# EAGLE design gyro+acc (EAGLE 6.1)
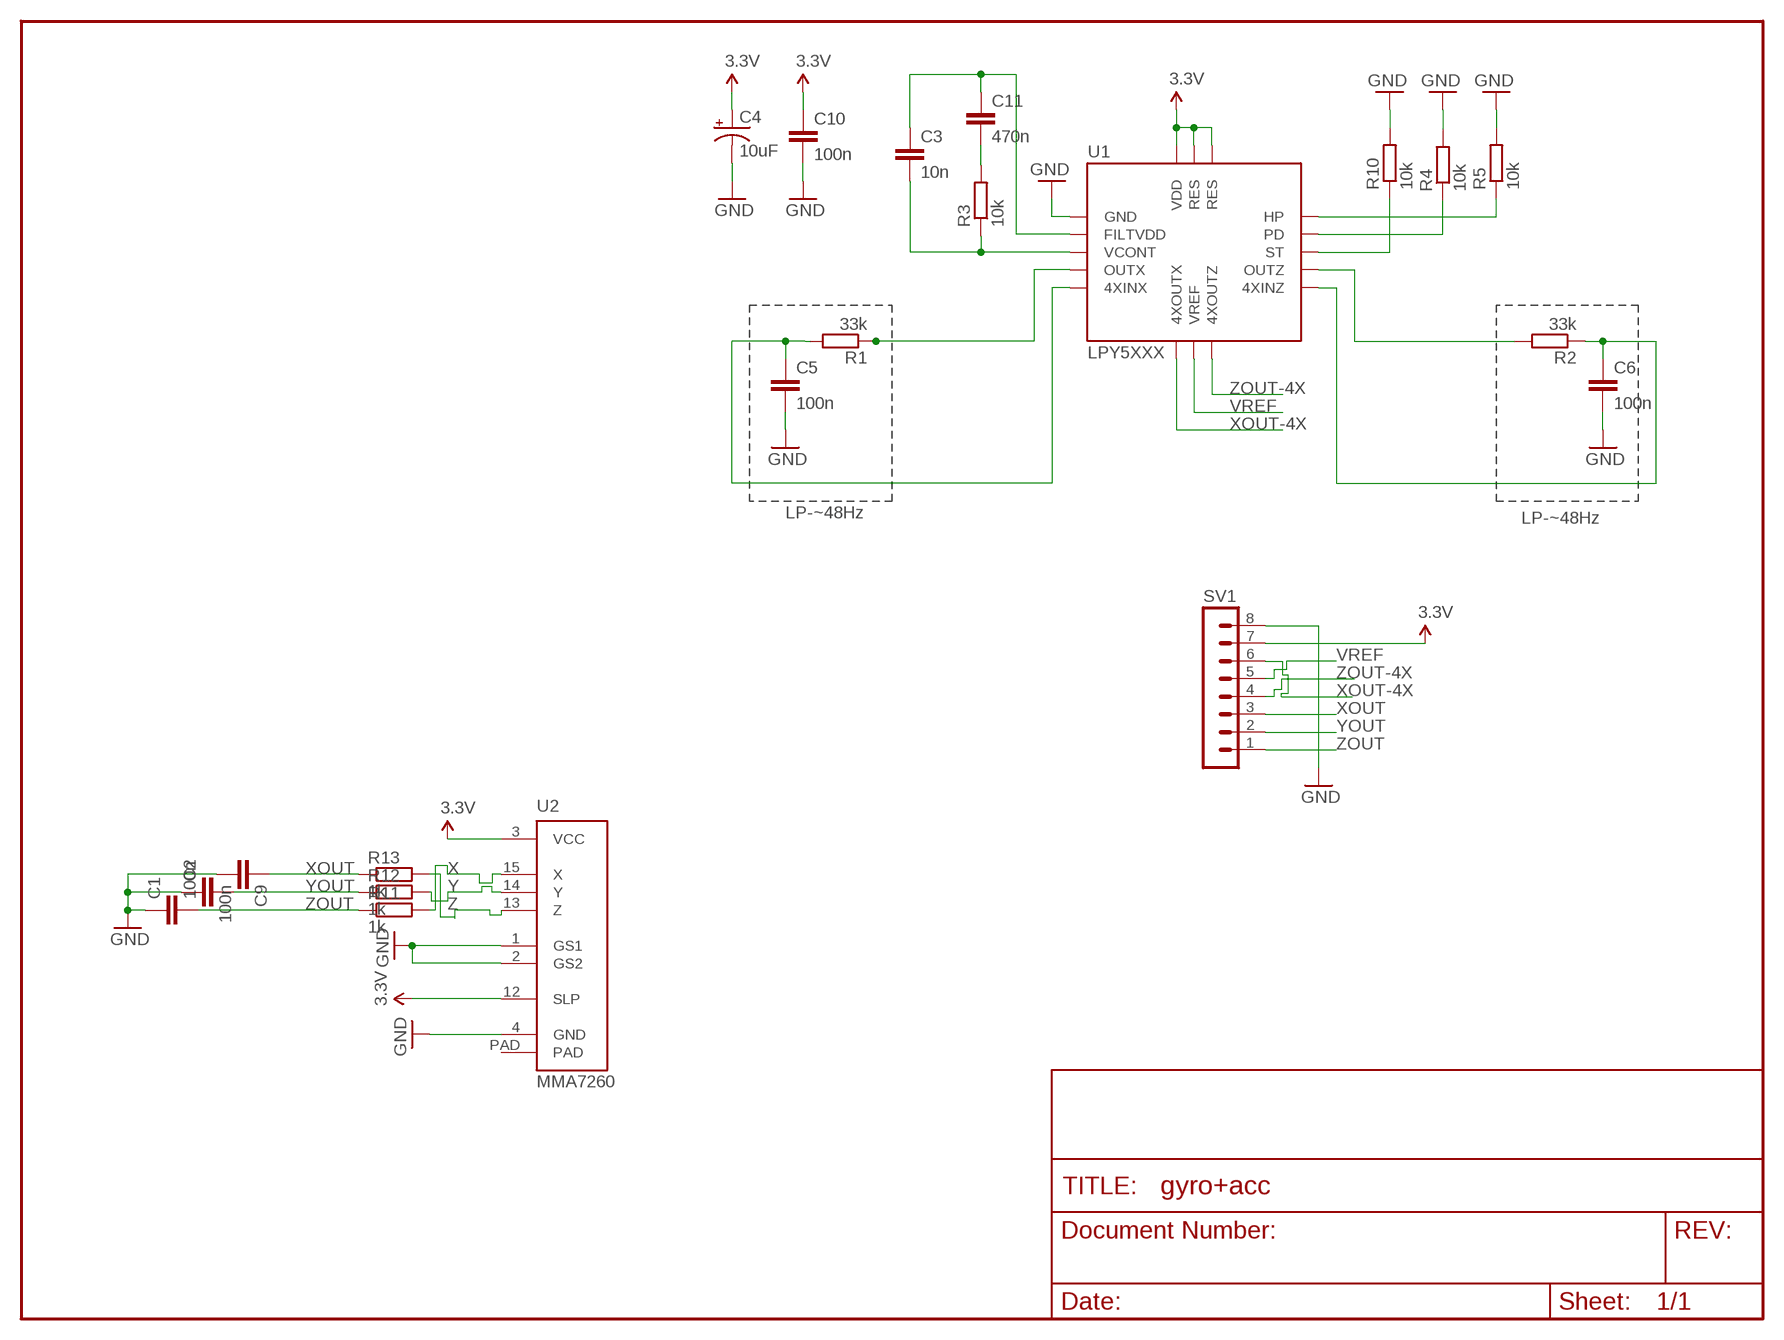
[diagram p0: schematic, sheet 1]

## Parts
C1  100n  C-EUC1206  [C1206]
C2  C-EUC1206  [C1206]
C3  10n  C-EUC1206  [C1206]
C4  10uF  CAP_POL1206  [EIA3216]
C5  100n  C-EUC1206  [C1206]
C6  100n  C-EUC1206  [C1206]
C9  100n  C-EUC1206  [C1206]
C10  100n  C-EUC1206  [C1206]
C11  470n  C-EUC1206  [C1206]
R1  33k  R-EU_M1206  [M1206]
R2  33k  R-EU_M1206  [M1206]
R3  10k  R-EU_M1206  [M1206]
R4  10k  R-EU_M1206  [M1206]
R5  10k  R-EU_M1206  [M1206]
R10  10k  R-EU_M1206  [M1206]
R11  1k  R-EU_M1206  [M1206]
R12  1k  R-EU_M1206  [M1206]
R13  1k  R-EU_M1206  [M1206]
SV1  MA08-1  [MA08-1]
U1  LPY5XXX  ST-GYRO-PYSMD  [ST-GYRO]
U2  MMA7260  [MMA7260]

## Nets
3.3V: C4.A(+) C10.1 SV1.7 U1.14(RES) U1.15(RES) U1.16(VDD) U2.3(VCC) U2.12(SLP)
F1: C3.1 C11.1 U1.2(FILTVDD)
F2: C3.2 R3.1 U1.3(VCONT)
GND: C1.1 C2.1 C4.C(-) C5.2 C6.2 C9.2 C10.2 R4.2 R5.2 R10.2 SV1.8 U1.1(GND) U2.1(GS1) U2.2(GS2) U2.4(GND)
HP: R5.1 U1.13(HP)
N$1: R1.1 U1.4(OUTX)
N$2: C11.2 R3.2
N$3: R2.2 U1.10(OUTZ)
PD: R4.1 U1.12(PD)
ST: R10.1 U1.11(ST)
VREF: SV1.5 U1.7(VREF)
X: R11.2 U2.15(X)
XOUT: C9.1 R13.1 SV1.3
XOUT-1X: C5.1 R1.2 U1.5(4XINX)
XOUT-4X: SV1.6 U1.6(4XOUTX)
Y: R12.2 U2.14(Y)
YOUT: C2.2 R12.1 SV1.2
Z: R13.2 U2.13(Z)
ZOUT: C1.2 R11.1 SV1.1
ZOUT-1X: C6.1 R2.1 U1.9(4XINZ)
ZOUT-4X: SV1.4 U1.8(4XOUTZ)
Unconnected: U2.PAD

## Notes on the sheet
- LP-~48Hz
- LP-~48Hz

## Library data of the parts
C1-C3 C5 C6 C9-C11 = rcl:C-EU: CAPACITOR, European symbol
C4 = SparkFun:CAP_POL: Capacitor Polarized These are standard SMD and PTH capacitors. Normally 10uF, 47uF, and 100uF in electrolytic and tantalum varieties. Always verify the external diameter of the through hole cap, it varies with capacity, voltage, and manufacturer. The EIA devices should be standard.
R1-R5 R10-R13 = resistor:R-EU_: RESISTOR, European symbol
SV1 = con-lstb:MA08-1: PIN HEADER; OC_FARNELL: unknown; OC_NEWARK: unknown
U1 = SparkFun:ST-GYRO-PY
U2 = SparkFun:MMA7260: MMA7260Q Triple axis accelerometer from Freescale. Schematic element and footprint production proven. Center pad has reduced paste layer for solder short reduction. Spark Fun Electronics SKU : COM-00308

## Board
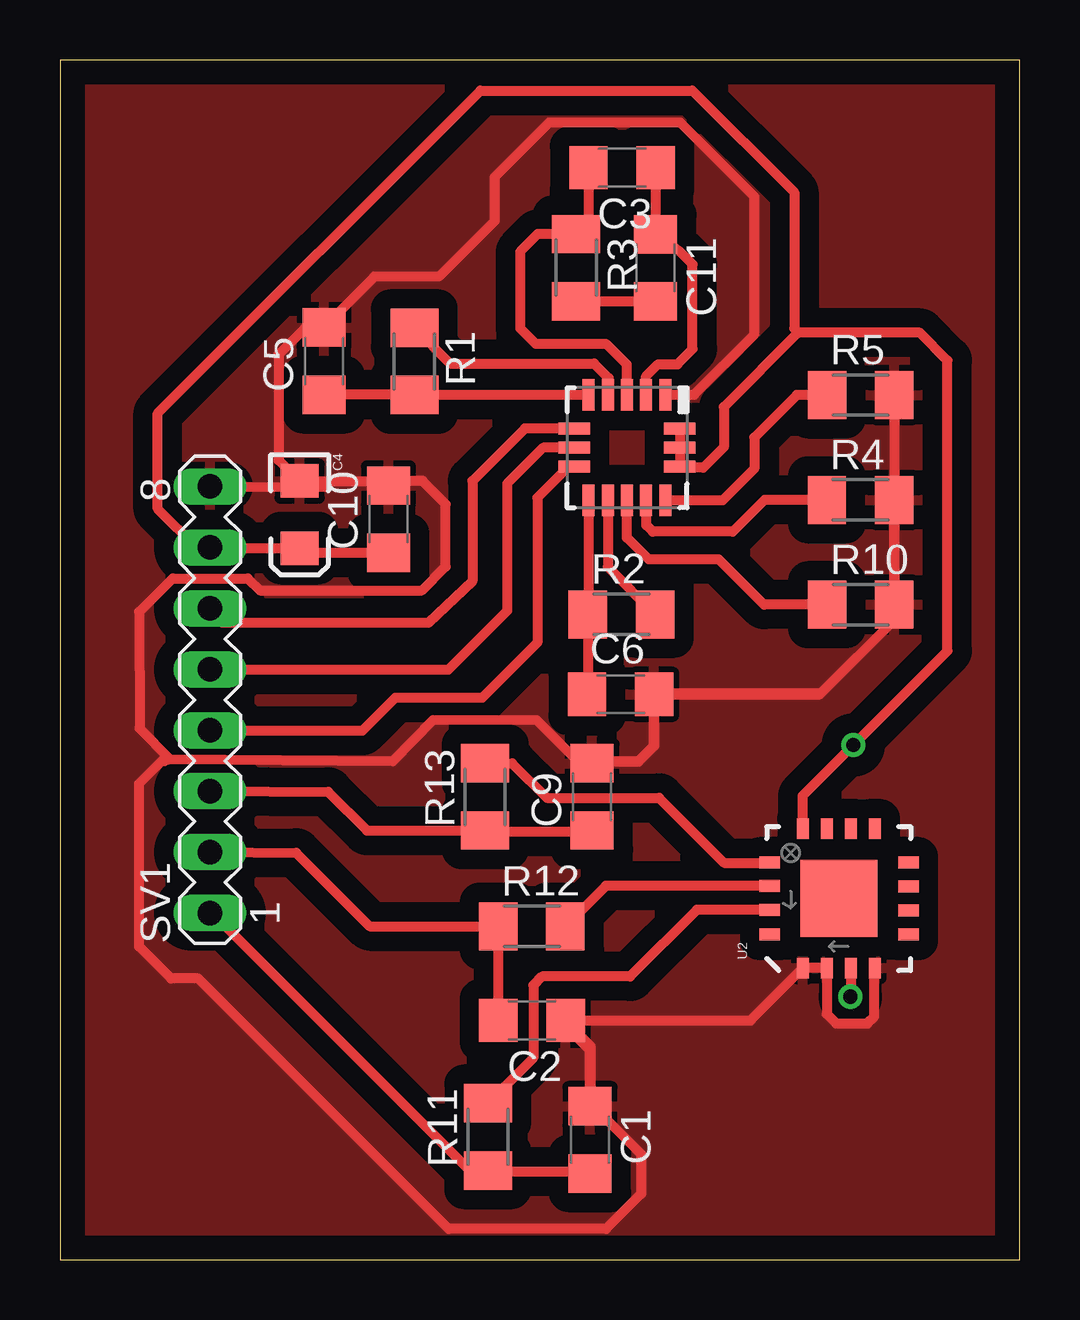
[diagram p1: board, top side]
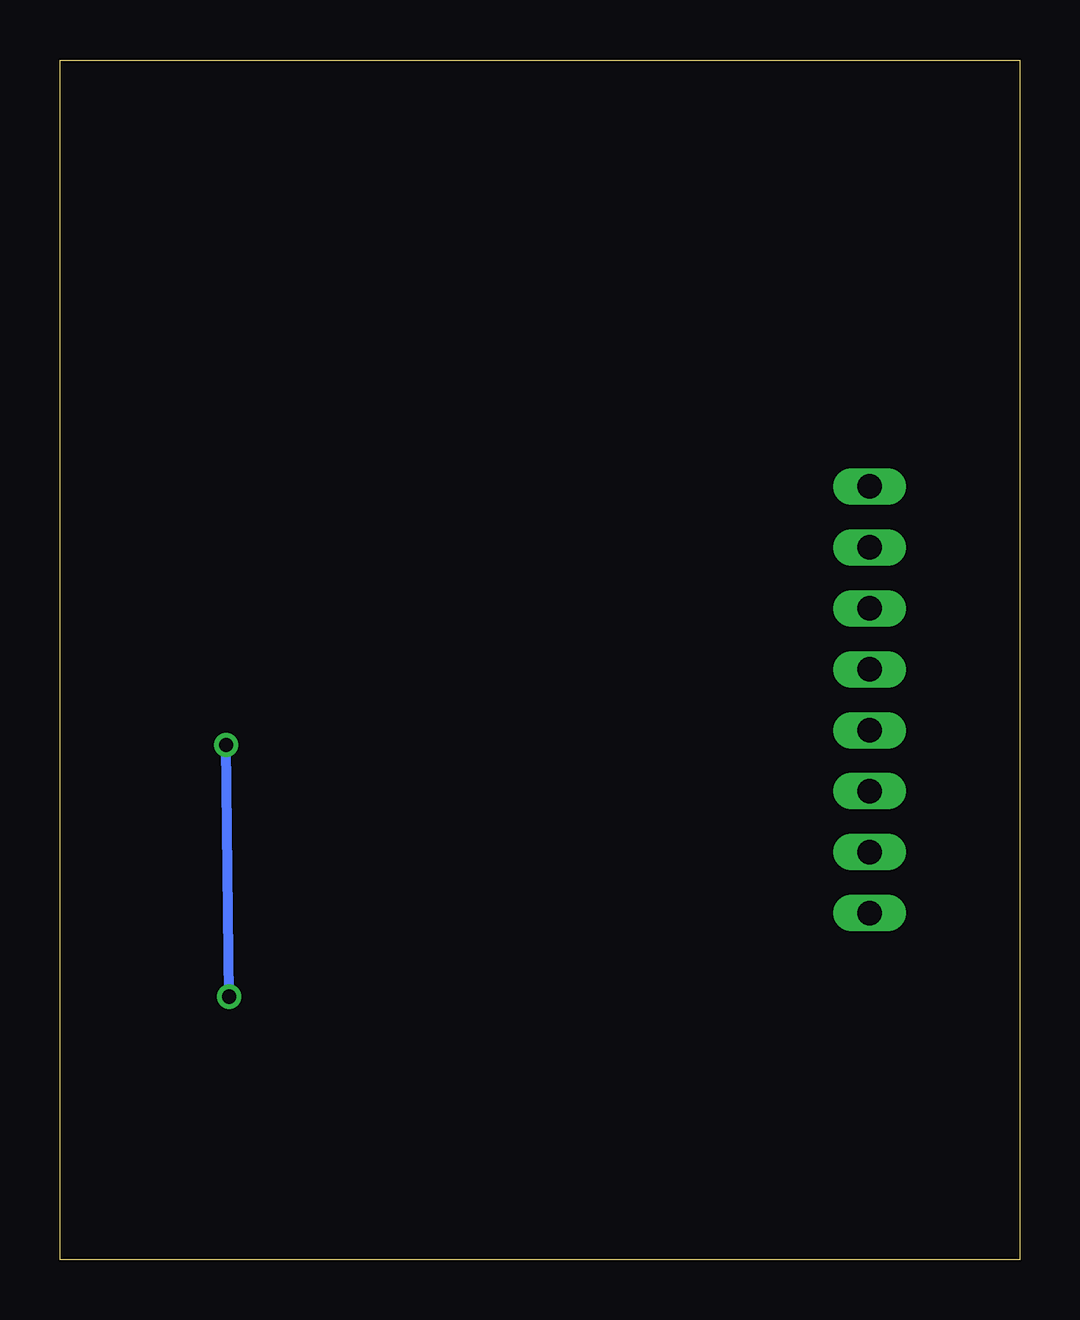
[diagram p2: board, bottom side, seen from below]

Size 40 x 50 mm. Coordinates in mm from the lower left corner, seen from the top.
Outline: 0,0 40,0 40,50 0,50 0,0
Copper layers (1*16): Top 0.035mm / dielectric 1.5mm / Bottom 0.035mm
Design rules: minimum track width 10mil, minimum drill 24mil, track to track 8mil, track to pad 8mil, pad to pad 8mil, via to via 8mil, smd to smd 8mil, copper to edge 40mil, drill to drill 8mil, minimum pad ring 10mil, minimum via ring 8mil, stop-mask expansion 4mil, vias tented up to drill 0mil, thermal gap 10mil

### Footprints (pad centres in the part's own frame; a part is rotated, then mirrored left to right if it is on the bottom)
C1206 = smd 1.6 x 1.8: 1 -1.4,0; 2 1.4,0
EIA3216 = smd 1.4 x 1.6: A 1.4,0; C -1.4,0
M1206 = smd 1.6 x 2: 1 -1.4,0; 2 1.4,0
MA08-1 = drill 1.016 long: 1 -8.89,0; 2 -6.35,0; 3 -3.81,0; 4 -1.27,0; 5 1.27,0; 6 3.81,0; 7 6.35,0; 8 8.89,0
ST-GYRO = smd 1.3 x 0.5: 1 -2.2,1.6; 2 -2.2,0.8; 3 -2.2,0; 4 -2.2,-0.8; 5 -2.2,-1.6; 9 2.2,-1.6; 10 2.2,-0.8; 11 2.2,0; 12 2.2,0.8; 13 2.2,1.6 | smd 0.5 x 1.3: 6 -0.8,-2.2; 7 0,-2.2; 8 0.8,-2.2; 14 0.8,2.2; 15 0,2.2; 16 -0.8,2.2
MMA7260 = smd 0.855 x 0.5: 1 -2.902,1.5; 2 -2.902,0.5; 3 -2.902,-0.5; 4 -2.902,-1.5; 9 2.902,-1.5; 10 2.902,-0.5; 11 2.902,0.5; 12 2.902,1.5 | smd 0.5 x 0.855: 5 -1.5,-2.902; 6 -0.5,-2.902; 7 0.5,-2.902; 8 1.5,-2.902; 13 1.5,2.877; 14 0.525,2.877; 15 -0.475,2.877; 16 -1.5,2.877 | smd 3.2 x 3.2: PAD 0,0

### Placement (x,y rotation side)
C1  22.1,4.99 270 top
C2  19.68,9.97 180 top
C3  23.43,45.51 180 top
C4  9.99,31.05 270 top
C5  11.01,37.45 90 top
C6  23.37,23.56 0 top
C9  22.18,19.29 90 top
C10  13.69,30.86 90 top
C11  24.83,41.34 270 top
R1  14.77,37.43 270 top
R2  23.41,26.9 0 top
R3  21.52,41.34 270 top
R4  33.37,31.66 0 top
R5  33.38,36.04 0 top
R10  33.38,27.29 0 top
R11  17.84,5.12 90 top
R12  19.67,13.89 0 top
R13  17.72,19.28 90 top
SV1  6.26,23.33 90 top
U1  23.64,33.84 270 top
U2  32.46,15.05 90 top

### Tracks (layer width: path | path; a pad name or v marks a point on that pad's centre or on a via)
3.3V  (via drill 0.6)
  Top 0.406: U1.16 U1.15 U1.14 25.86,33.06 25.82,33.02 25.84,33.01 26.82,33.01 27.67,33.86 27.67,35.53 30.77,38.63 | U2.12 30.96,19.34 v33.07,21.45 37,25.37 37,37.48 35.84,38.63 30.77,38.63 | 30.77,38.63 30.78,38.62 | 30.77,38.63 30.71,38.69 30.71,38.7 30.61,38.81 30.61,44.48 26.36,48.72 17.53,48.72 4.08,35.27 4.08,31.28 5.73,29.63 5.78,29.67 SV1.7 | SV1.7 6.3,29.67 6.32,29.65 C4.A 10.18,29.46 C10.1 | SV1.7 | U2.3 32.96,10.97 v32.95,10.96
  Bottom 0.406: v32.95,10.96 v33.07,21.45
F1
  Top 0.406: C3.1 C11.1 24.82,42.73 24.81,42.73 | U1.2 24.43,36.82 24.93,37.32 25.74,37.32 26.37,37.95 26.37,41.48 25.85,42.01 24.81,42.73 | 24.81,42.73 24.76,42.73 | 24.73,42.73 24.76,42.73 | 24.76,42.73 24.78,42.71 24.9,42.71 24.93,42.69
F2
  Top 0.406: C3.2 22.03,43.26 R3.1 19.91,42.74 19.18,42.01 19.18,38.82 19.83,38.17 22.76,38.17 23.62,37.31 23.62,36.11 23.68,36.04 | U1.3 23.68,36.04 | 23.68,36.04
GND
  Top 0.406: SV1.8 11.17,32.2 C4.C | C4.C 14.2,32.45 | 14.2,32.45 C10.2 | 34.78,26.66 R10.2 34.77,27.3 R4.2 34.78,31.67 R5.2 34.78,26.66 31.7,23.59 24.82,23.59 24.75,23.51 24.75,21.41 24.08,20.75 22.2,20.75 22.18,20.73 21.63,20.73 19.89,22.47 15.54,22.48 13.87,20.77 4.6,20.85 | C6.2 | C6.2 24.77,21.41 24.12,20.76 22.34,20.76 22.22,20.64 22.22,20.65 C9.2 | C6.2 31.68,23.56 34.78,26.66 | 34.78,26.66 34.81,26.69 34.81,26.71 34.8,26.72 | U1.1 26.43,36.04 28.94,38.56 28.94,44.31 25.86,47.39 20.39,47.39 18.12,45.12 18.12,43.29 15.8,40.97 13.11,40.97 10.99,38.85 | 10.99,38.86 C5.2 10.99,38.85 | C1.1 22.1,8.72 20.98,9.83 | 20.98,9.83 | 20.98,9.83 21.08,9.94 | 10.99,38.85 10.23,38.85 9.11,37.73 9.11,33.31 10.02,32.4 10.02,32.42 C4.C | 21.08,9.94 22.11,8.91 22.11,6.52 24.22,4.4 24.22,2.73 22.76,1.28 16.21,1.28 5.77,11.72 4.63,11.72 3.3,13.05 3.3,19.83 4.26,20.8 4.32,20.8 4.35,20.77 | 14.2,32.45 15.12,32.45 16.08,31.49 16.08,28.88 15.09,27.89 8.34,27.89 7.83,28.39 4.7,28.39 3.3,26.99 3.32,22.14 4.6,20.85 | 4.6,20.85 4.35,20.77 | 4.35,20.77 4.24,20.77 | 21.08,9.94 C2.1 | 21.08,9.94 C2.1 28.79,9.97 U2.1 U2.2 31.96,10.23 32.36,9.84 33.67,9.84 33.95,10.12 33.95,12.11 | 33.95,12.11 33.95,12.17 33.94,12.18 33.94,12.13 | U2.4 33.96,12.13 33.95,12.11
  pour Top (isolate 0.813): 0,49.53 40.64,49.53 40.64,0 0,0
HP
  Top 0.406: R5.1 30.71,36.04 28.94,34.26 28.94,32.97 27.61,31.64 U1.13
N$1
  Top 0.406: R1.1 16.26,37.34 22.27,37.34 22.87,36.74 22.87,36.08 U1.4
N$2
  Top 0.406: C11.2 R3.2
N$3
  Top 0.406: U1.10 22.84,28.87 R2.2
PD
  Top 0.406: R4.1 29.37,31.66 28.04,30.34 24.72,30.34 24.44,30.61 U1.12
ST
  Top 0.406: R10.1 29.35,27.29 27.46,29.18 24.54,29.18 23.63,30.09 U1.11
VREF
  Top 0.406: U1.7 20.14,33.84 18.64,32.33 18.64,27.03 16.18,24.58 6.84,24.58 SV1.5
X
  Top 0.406: U2.15 26.55,14.57 23.77,11.79 20.1,11.79 19.73,11.43 19.73,8.41 R11.2
XOUT
  Top 0.406: SV1.3 11.18,19.5 12.79,17.89 17.55,17.89 17.64,17.97 17.68,17.97 17.72,17.93 | 17.72,17.93 | 17.72,17.93 17.8,17.84 22.14,17.84 C9.1 | 17.72,17.93 R13.1
XOUT-1X
  Top 0.406: U1.5 14.78,36.04 R1.2 14.76,36.05 C5.1
XOUT-4X
  Top 0.406: U1.6 19.38,34.64 17.19,32.45 17.19,28.27 15.34,26.53 6.76,26.53 SV1.6
Y
  Top 0.406: U2.14 22.75,15.57 R12.2
YOUT
  Top 0.406: SV1.2 9.85,16.96 12.91,13.89 18.16,13.89 18.24,13.81 18.36,13.81 18.4,13.85 18.4,13.77 18.39,13.77 R12.1 C2.2
Z
  Top 0.406: R13.2 18.85,20.68 20.29,19.24 24.98,19.24 27.68,16.53 29.57,16.53 U2.13
ZOUT
  Top 0.406: SV1.1 6.84,13.95 17.19,3.6 18.04,3.6 18.12,3.68 | 17.8,3.68 17.92,3.68 | R11.1 17.88,3.72 17.92,3.68 | 18.12,3.68 17.92,3.68 | 18.12,3.68 22.01,3.68 C1.2
ZOUT-1X
  Top 0.406: U1.9 22.04,26.93 R2.1 22.01,23.6 C6.1
ZOUT-4X
  Top 0.406: U1.8 21.19,33.04 19.9,31.75 19.9,25.72 17.6,23.41 13.98,23.41 12.6,22.03 6.84,22.03 SV1.4